# EasyEDA schematic DashBoard powerbox.json
TITLE: Sheet_1; REV: 1.0; Date: 2024-01-21; Sheet: 1/1; Drawn By: dumitrescu.florin94; Company: Your Company
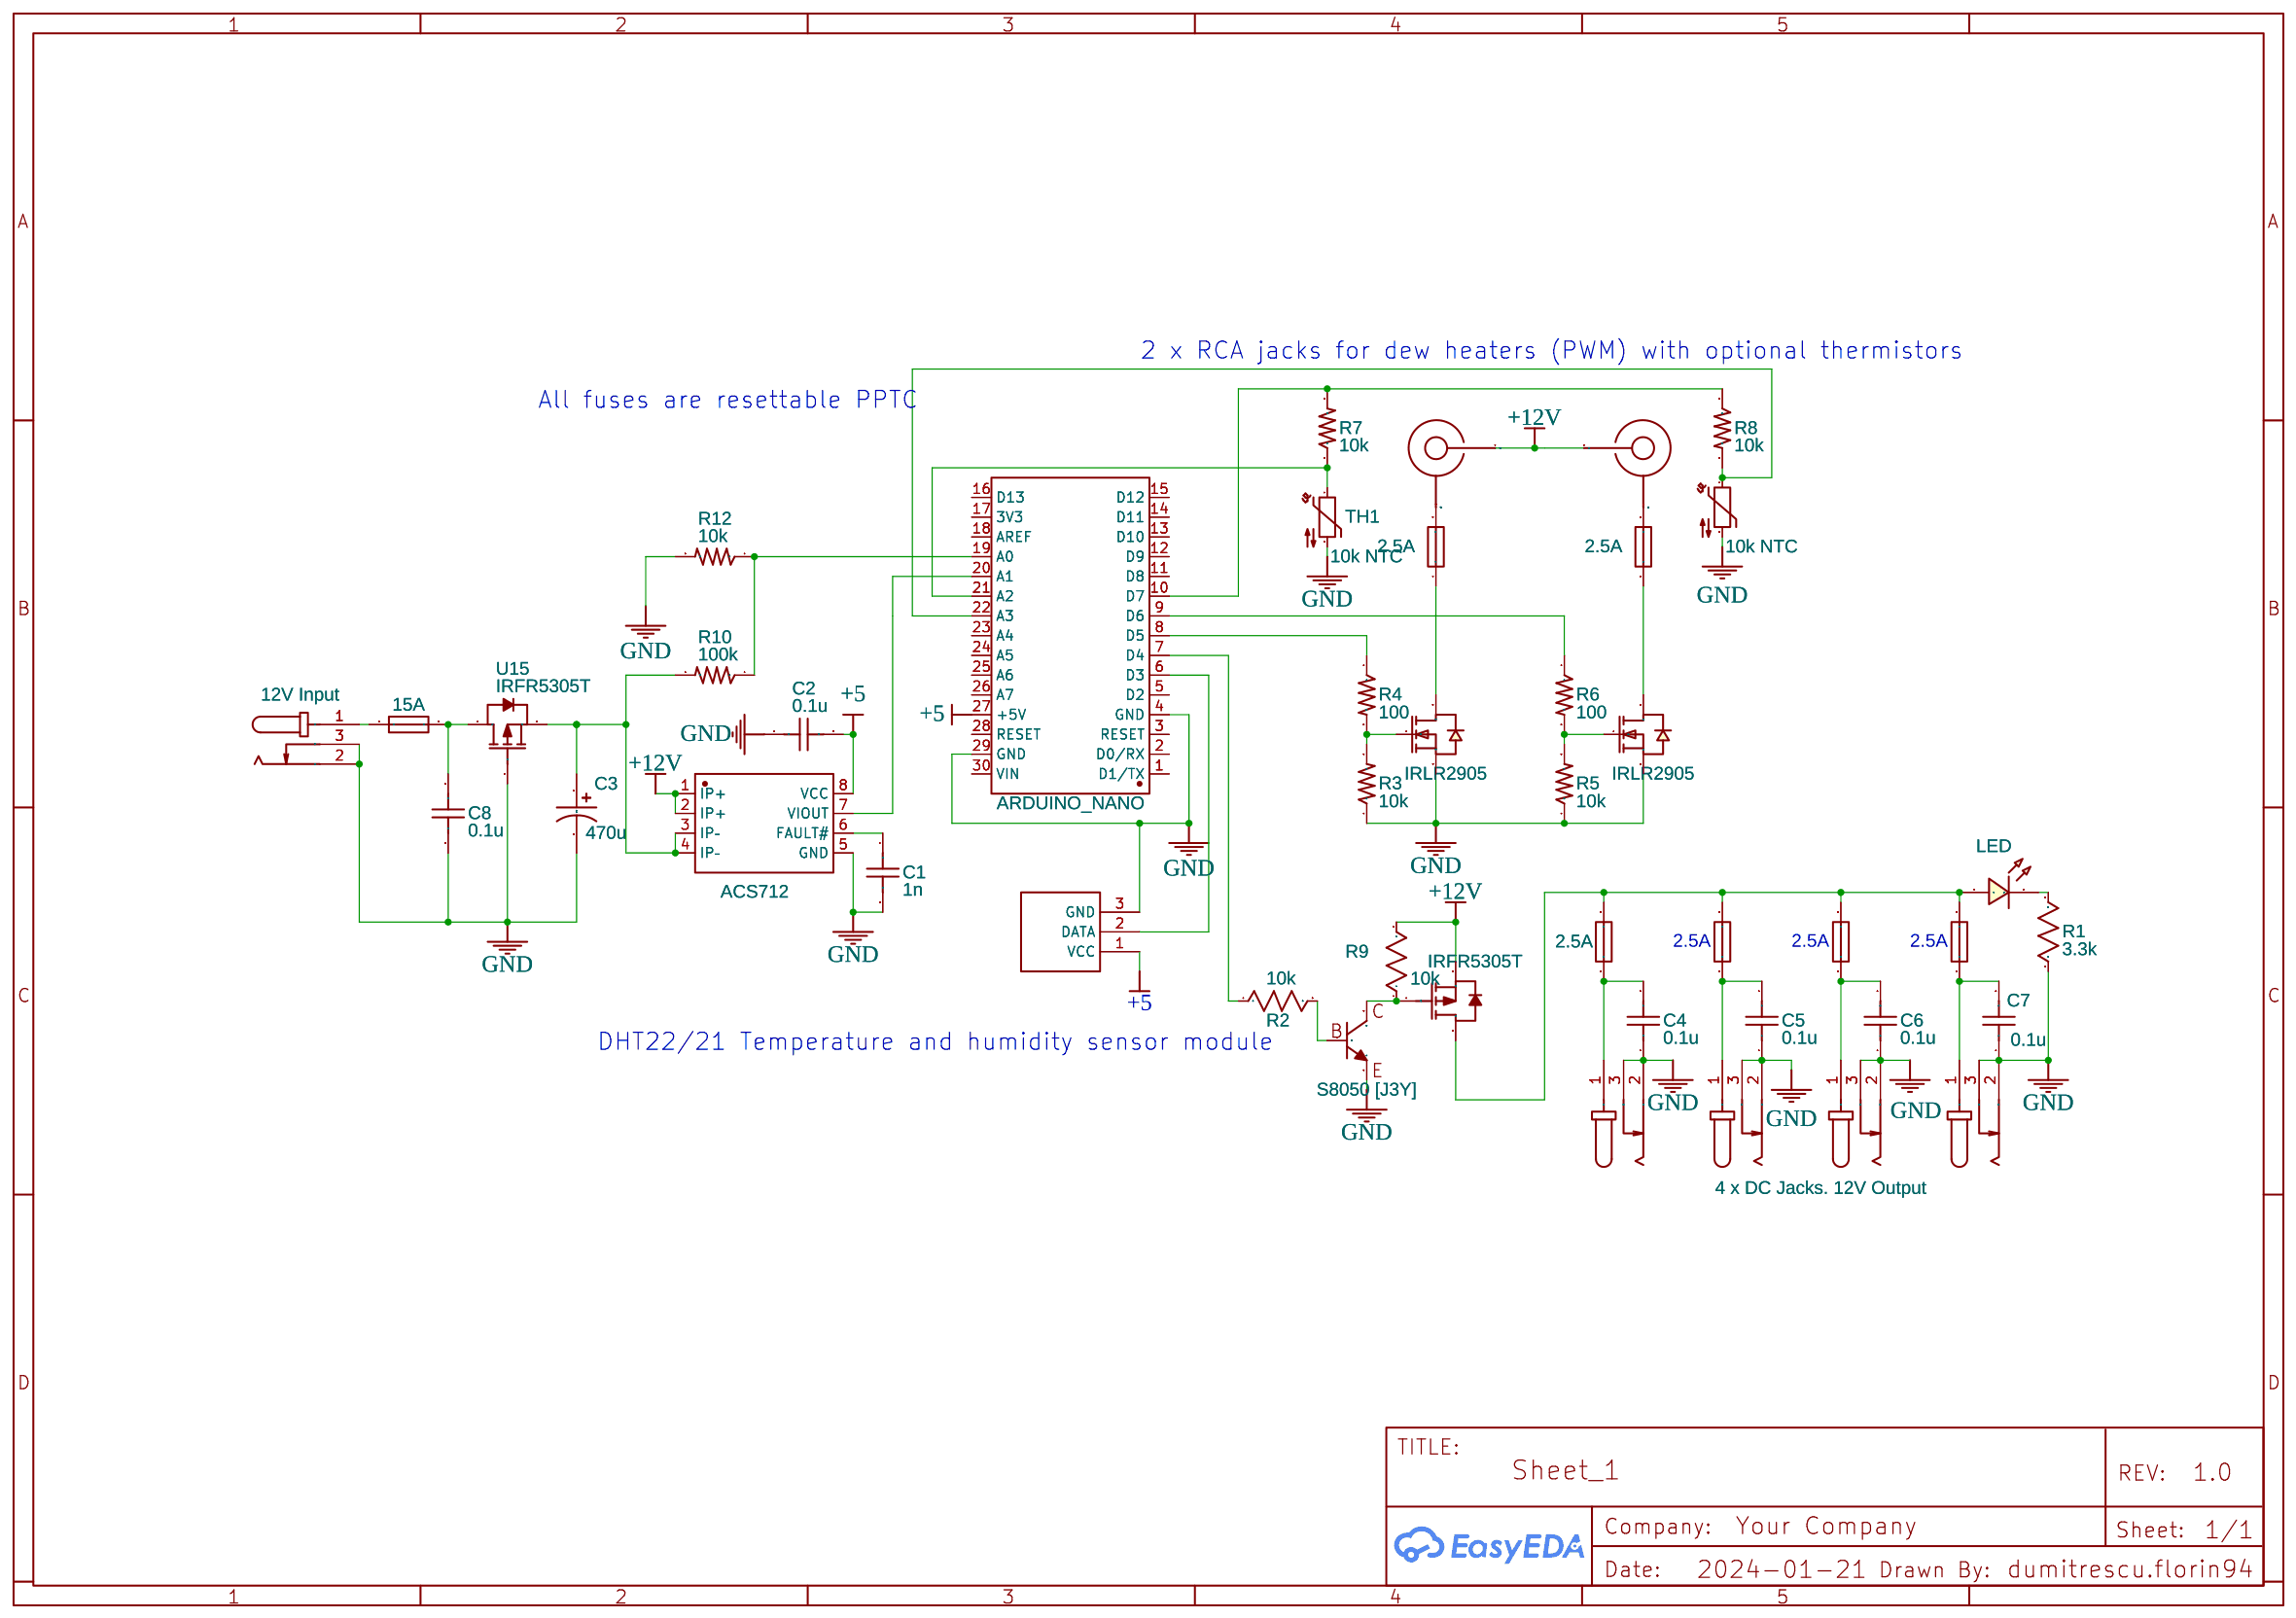
[diagram p0: schematic sheet]

## Parts
ACS712  ACS71240LLCBTR-030B3  [SOIC-8_L4.9-W3.9-P1.27-LS6.0-BL]
ARDUINO_NANO  ARDUINO_NANO  [COMM-TH_ARDUINO_NANO]
C1  1n  [C0603]
C2  0.1u  [C1206]
C3  470u  [CAP-D10.0×F5.0_MG]
C4  0.1u  [C1206]
C5  0.1u  [C1206]
C6  0.1u  [C1206]
C7  0.1u  [C1206]
C8  0.1u  [C1206]
F1  15A  [PPTC FUSE 10MM]
F2  2.5A  [PPTC_2.5A]
F3  2A  [PPTC_2.5A]
F4  2A  [PPTC_2.5A]
F5  2A  [PPTC_2.5A]
F6  2.5A  [PPTC_2.5A]
F7  2.5A  [PPTC_2.5A]
IN1  12V Input  [DC-IN-TH_POWER-JACK]
LED1  LED  [LED-TH_BD5.0_RED]
R1  3.3k  [0805]
R2  10k  [0805]
R3  10k  [0805]
R4  100  [0805]
R5  10k  [0805]
R6  100  [0805]
R7  10k  [0805]
R8  10k  [0805]
R9  10k  [0805]
R10  100k  [0805]
R12  10k  [0805]
TH1  10k NTC  [CONN-TH_2P-P4.00_VH2-HEADER2]
TH2  10k NTC  [CONN-TH_2P-P4.00_VH2-HEADER2]
U1  input left SE  [CONN-TH_2P-P4.00_VH2-HEADER2]
U2  input left SE  [CONN-TH_2P-P4.00_VH2-HEADER2]
U3  IRFR5305T  [TO-252-3_L6.5-W5.8-P4.60-LS9.9-BR]
U5  IRLR2905  [TO-252-2_L6.6-W6.1-P4.57-LS9.9-BR-CW]
U8  POWER-JACK  [DC-IN-TH_POWER-JACK]
U9  POWER-JACK  [DC-IN-TH_POWER-JACK]
U10  POWER-JACK  [DC-IN-TH_POWER-JACK]
U11  4 x DC Jacks. 12V Output  [DC-IN-TH_POWER-JACK]
U12  IRLR2905  [TO-252-2_L6.6-W6.1-P4.57-LS9.9-BR-CW]
U13  DHT22-MODULE  [CONN-TH_3P-P5.08_HEADER3]
U14  S8050 [J3Y]  [SOT-23-3 (S8050-J3Y)_L2.9-W1.3-P1.90-LS2.4-BR]
U15  IRFR5305T  [TO-252-3_L6.5-W5.8-P4.60-LS9.9-BR]

## Library data of the parts
ACS712 = ACS71240LLCBTR-030B3: Contributor: LCSC; Supplier: LCSC; Supplier Part: C2654896; Manufacturer: ALLEGRO(美国埃戈罗); JLCPCB Part Class: Extended Part; link: https://lcsc.com/eda_search?q=C2654896&%26type=1&ref=editor
ARDUINO_NANO = ARDUINO_NANO: Contributor: lcsc; Supplier: LCSC; Supplier Part: C9900017879; Manufacturer: null; JLCPCB Part Class: Extended Part; link: https://lcsc.com/eda_search?q=C9900017879&%26type=1&ref=editor
C1 C2 C4-C8 = C_0603_US: Contributor: LCEDA_Lib
C3 = CE_TH_D10.0×F5.0_US: Contributor: LCEDA_Lib
F1-F7 = 0326025.MXP: Contributor: lcsc; Supplier: LCSC; Supplier Part: C178977; Manufacturer: Littelfuse(美国力特); JLCPCB Part Class: Extended Part; link: https://lcsc.com/eda_search?q=C178977&%26type=1&ref=editor
IN1 U8-U11 = POWER-JACK: Contributor: LCSC; Supplier: LCSC; Supplier Part: C9900001795; Manufacturer: 索峰; JLCPCB Part Class: Extended Part; link: https://lcsc.com/eda_search?q=C9900001795&%26type=1&ref=editor
LED1 = LED-TH-5mm_R: Manufacturer: EVERLIGHT(台湾亿光); Manufacturer Part: 333-2SURD/S530-A3; Supplier Part: C87271; Supplier: LCSC; Contributor: LCEDA_Lib
R1 R2 R9 = R_0201_US: Contributor: LCEDA_Lib
R3-R8 R10 R12 = RESISTORPTH-16W: Resistor; Contributor: SparkFun
TH1 TH2 = Thermistor_NTC: Contributor: KiCAD; license: https://www.gnu.org/licenses/lgpl-2.1.html
U1 U2 = RCA Phono: Contributor: ahajnal
U3 U15 = IRFR5305T: Contributor: lcsc; Supplier: LCSC; Supplier Part: C5261062; Manufacturer: HXY MOSFET(华轩阳电子); JLCPCB Part Class: Extended Part; link: https://lcsc.com/eda_search?q=C5261062&%26type=1&ref=editor
U5 U12 = IRLR2905: Contributor: lcsc; Supplier: LCSC; Supplier Part: C5350899; Manufacturer: TECH PUBLIC(台舟); link: https://lcsc.com/eda_search?q=C5350899&%26type=1&ref=editor
U13 = DHT22-MODULE: Contributor: Clyasenth
U14 = S8050 [J3Y]: Contributor: ARNABMACH0; Supplier: LCSC; Supplier Part: C3011093; Manufacturer: JUXING(钜兴); Manufacturer Part: S8050; JLCPCB Part Class: Extended Part

## Nets
+12V: ACS712.1(IP+) ACS712.2(IP+) R9.2 U1.1(SIG) U2.1(SIG) U3.3(S)
GND: ACS712.5(GND) ARDUINO_NANO.4(GND) ARDUINO_NANO.29(GND) C1.2 C2.1 C3.2 C4.1 C5.1 C6.1 C7.1 C8.2 IN1.2 IN1.3 R1.1 R3.1 R5.1 R12.2 TH1.2 TH2.2 U5.3(S) U8.2 U8.3 U9.2 U9.3 U10.2 U10.3 U11.2 U11.3 U12.3(S) U13.3(GND) U14.2(E) U15.1(G)
+5: ACS712.8(VCC) ARDUINO_NANO.27(+5V) C2.2 U13.1(VCC)
Net-(ACS712-3): ACS712.3(IP–) ACS712.4(IP–) C3.1 R10.2 U15.3(S)
Net-(ACS712-6): ACS712.6(FAULT#) C1.1
Net-(ACS712-7): ACS712.7(VIOUT) ARDUINO_NANO.20(A1)
Net-(ARDUINO_NANO-6): ARDUINO_NANO.6(D3) U13.2(DATA)
Net-(ARDUINO_NANO-7): ARDUINO_NANO.7(D4) R2.1
Net-(ARDUINO_NANO-8): ARDUINO_NANO.8(D5) R4.1
Net-(ARDUINO_NANO-9): ARDUINO_NANO.9(D6) R6.1
Net-(ARDUINO_NANO-10): ARDUINO_NANO.10(D7) R7.2 R8.1
Net-(ARDUINO_NANO-19): ARDUINO_NANO.19(A0) R10.1 R12.1
Net-(ARDUINO_NANO-21): ARDUINO_NANO.21(A2) R7.1 TH1.1
Net-(ARDUINO_NANO-22): ARDUINO_NANO.22(A3) R8.2 TH2.1
Net-(C4-2): C4.2 F2.1 U8.1
Net-(C5-2): C5.2 F3.1 U9.1
Net-(C6-2): C6.2 F4.1 U10.1
Net-(C7-2): C7.2 F5.1 U11.1
Net-(C8-1): C8.1 F1.2 U15.2(D)
Net-(F1-1): F1.1 IN1.1
Net-(F2-2): F2.2 F3.2 F4.2 F5.2 LED1.1 U3.2(D)
Net-(F6-1): F6.1 U5.2(D)
Net-(F6-2): F6.2 U1.2(GND)
Net-(F7-1): F7.1 U12.2(D)
Net-(F7-2): F7.2 U2.2(GND)
Net-(LED1-2): LED1.2 R1.2
Net-(R2-2): R2.2 U14.1(B)
Net-(R3-2): R3.2 R4.2 U5.1(G)
Net-(R5-2): R5.2 R6.2 U12.1(G)
Net-(R9-1): R9.1 U3.1(G) U14.3(C)

Not connected (* = marked no-connect by the designer): ARDUINO_NANO 1(D1/TX) 2(D0/RX) 3(RESET) 5(D2) 11(D8) 12(D9) 13(D10) 14(D11) 15(D12) 16(D13) 17(3V3) 18(AREF) 23(A4) 24(A5) 25(A6) 26(A7) 28(RESET) 30(VIN)

## Notes on the sheet
- 2 x RCA jacks for dew heaters (PWM) with optional thermistors
- All fuses are resettable PPTC
- 2.5A
- 2.5A
- 2.5A
- DHT22/21 Temperature and humidity sensor module
